# Altium schematic sheet synth.SchDoc
size A; SheetNumber: 1; SheetTotal: 1
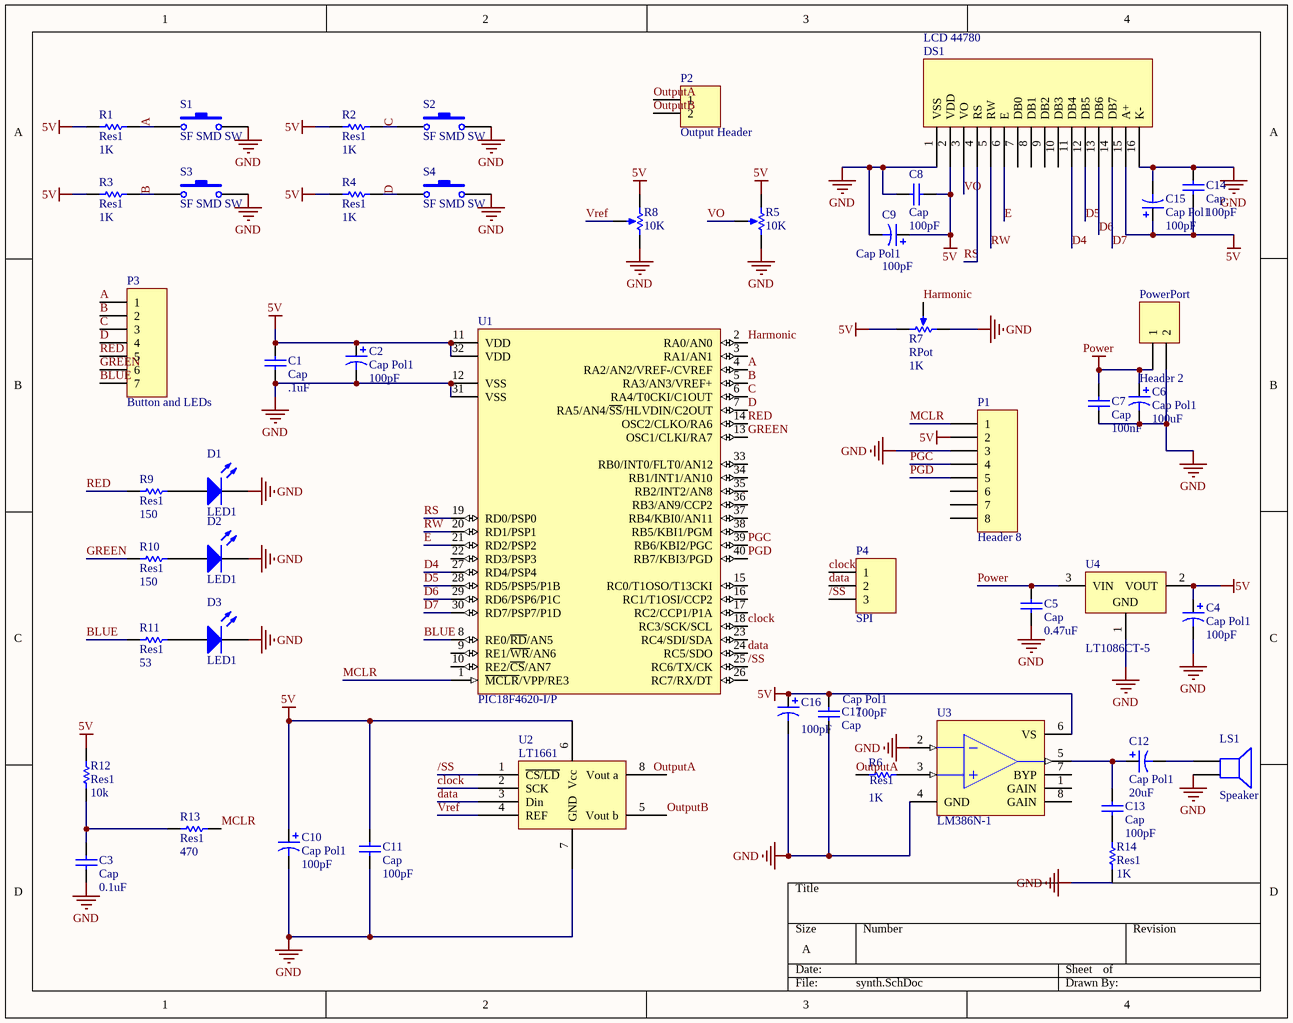
[diagram p0: synth.SchDoc]

## Parts
C1  Cap  value .1uF  [RAD-0.3]
C2  Cap Pol1  value 100pF  [RB7.6-15]
C3  Cap  value 0.1uF  [RAD-0.3]
C4  Cap Pol1  value 100pF  [RB7.6-15]
C5  Cap  value 0.47uF  [RAD-0.3]
C6  Cap Pol1  value 100uF  [RB7.6-15]
C7  Cap  value 100nF  [RAD-0.3]
C8  Cap  value 100pF  [RAD-0.3]
C9  Cap Pol1  value 100pF  [RB7.6-15]
C10  Cap Pol1  value 100pF  [RB7.6-15]
C11  Cap  value 100pF  [RAD-0.3]
C12  Cap Pol1  value 20uF  [RB7.6-15]
C13  Cap  value 100pF  [RAD-0.3]
C14  Cap  value 100pF  [RAD-0.3]
C15  Cap Pol1  value 100pF  [RB7.6-15]
C16  Cap Pol1  value 100pF  [RB7.6-15]
C17  Cap  value 100pF  [RAD-0.3]
D1  LED1  [LED-1]
D2  LED1  [LED-1]
D3  LED1  [LED-1]
DS1  LCD 44780  [OLED 16x2]
LS1  Speaker  [PIN2]
P1  Header 8  [HDR1X8]
P2  Output Header  [HDR1X2]
P3  Button and LEDs  [HDR1X7]
P4  SPI  [HDR1X3]
PowerPort  Header 2  [HDR1X2]
R1  Res1  value 1K  [AXIAL-0.3]
R2  Res1  value 1K  [AXIAL-0.3]
R3  Res1  value 1K  [AXIAL-0.3]
R4  Res1  value 1K  [AXIAL-0.3]
R5  value 10K  [Rpot Square in line]  (hidden comment: RPot_3)
R6  Res1  value 1K  [AXIAL-0.3]
R7  RPot  value 1K  [VR5]
R8  value 10K  [Rpot Square in line]  (hidden comment: RPot_3)
R9  Res1  value 150  [AXIAL-0.3]
R10  Res1  value 150  [AXIAL-0.3]
R11  Res1  value 53  [AXIAL-0.3]
R12  Res1  value 10k  [AXIAL-0.3]
R13  Res1  value 470  [AXIAL-0.3]
R14  Res1  value 1K  [AXIAL-0.3]
S1  SF SMD SW  [SW PB]
S2  SF SMD SW  [SW PB]
S3  SF SMD SW  [SW PB]
S4  SF SMD SW  [SW PB]
U1  PIC18F4620-I/P  [PDIP600-P40]
U2  LT1661  [DIP-8]
U3  LM386N-1  [DIP-8]
U4  LT1086CT-5  [LT-T-3]

## Nets
5V: C1.2 C2.1 C4.1 C8.2 C9.1 C10.1 C11.2 C14.1 C15.1 C16.1 C17.2 DS1.2(VDD) DS1.15(A+) P1.2 R1.1 R2.1 R3.1 R4.1 R5.1(TOP) R7.2(BOT) R8.1(TOP) R12.2 U1.11(VDD) U1.32(VDD) U2.6(Vcc) U3.6(VS) U4.2(VOUT)
GND: C1.1 C2.2 C3.1 C4.2 C5.1 C6.2 C7.1 C8.1 C9.2 C10.2 C11.1 C14.2 C15.2 C16.2 C17.1 D1.2(K) D2.2(K) D3.2(K) DS1.1(VSS) DS1.16(K-) LS1.2 P1.3 PowerPort.2 R5.3(BOT) R7.1(TOP) R8.3(BOT) R14.1 S1.2 S2.2 S3.2 S4.2 U1.12(VSS) U1.31(VSS) U2.7(GND) U3.2(IN-) U3.4(GND) U4.1(GND)
Power: C5.2 C6.1 C7.2 PowerPort.1 U4.3(VIN)
/SS: P4.3 U1.25(RC6/TX/CK) U2.1(~{CS/LD})
A: P3.1 R1.2 S1.1 U1.4(RA2/AN2/VREF-/CVREF)
B: P3.2 R3.2 S3.1 U1.5(RA3/AN3/VREF+)
BLUE: P3.7 R11.1 U1.8(RE0/~{RD}/AN5)
C: P3.3 R2.2 S2.1 U1.6(RA4/T0CKI/C1OUT)
clock: P4.1 U1.18(RC3/SCK/SCL) U2.2(SCK)
D: P3.4 R4.2 S4.1 U1.7(RA5/AN4/~{SS}/HLVDIN/C2OUT)
D4: DS1.11(DB4) U1.27(RD4/PSP4)
D5: DS1.12(DB5) U1.28(RD5/PSP5/P1B)
D6: DS1.13(DB6) U1.29(RD6/PSP6/P1C)
D7: DS1.14(DB7) U1.30(RD7/PSP7/P1D)
data: P4.2 U1.24(RC5/SDO) U2.3(Din)
E: DS1.6(E) U1.21(RD2/PSP2)
GREEN: P3.6 R10.1 U1.13(OSC1/CLKI/RA7)
Harmonic: R7.3(TAP) U1.2(RA0/AN0)
MCLR: P1.1 R13.2 U1.1(~{MCLR}/VPP/RE3)
OutputA: P2.1 R6.1
OutputB: P2.2 U2.5(Vout_b)
PGC: P1.4 U1.39(RB6/KBI2/PGC)
PGD: P1.5 U1.40(RB7/KBI3/PGD)
RED: P3.5 R9.1 U1.14(OSC2/CLKO/RA6)
RS: DS1.4(RS) U1.19(RD0/PSP0)
RW: DS1.5(RW) U1.20(RD1/PSP1)
VO: DS1.3(VO) R5.2(TAP)
Vref: R8.2(TAP) U2.4(REF)
NetC3_2: C3.2 R12.1 R13.1
NetC12_1: C12.1 C13.2 U3.5(OUT)
NetC12_2: C12.2 LS1.1
NetC13_1: C13.1 R14.2
NetD1_1: D1.1(A) R9.2
NetD2_1: D2.1(A) R10.2
NetD3_1: D3.1(A) R11.2
NetR6_2: R6.2 U3.3(IN+)

Not connected (* = marked no-connect by the designer): DS1 7(DB0) 8(DB1) 9(DB2) 10(DB3); P1 6 7 8; U1 3(RA1/AN1) 9(RE1/~{WR}/AN6) 10(RE2/~{CS}/AN7) 15(RC0/T1OSO/T13CKI) 16(RC1/T1OSI/CCP2) 17(RC2/CCP1/P1A) 22(RD3/PSP3) 23(RC4/SDI/SDA) 26(RC7/RX/DT) 33(RB0/INT0/FLT0/AN12) 34(RB1/INT1/AN10) 35(RB2/INT2/AN8) 36(RB3/AN9/CCP2) 37(RB4/KBI0/AN11) 38(RB5/KBI1/PGM); U2 8(Vout_a); U3 1(GAIN) 7(BYP) 8(GAIN)

## Notes on the sheet
- Labels drawn without touching a wire or pin: OutputA

## Library data of the parts
C1 C3 C5 C7 C8 C11 C13 C14 C17 = Cap: Capacitor; Published: 8-Jun-2000; LatestRevisionDate: 17-Jul-2002; LatestRevisionNote: Re-released for DXP Platform.; PackageReference: RAD-0.3; Publisher: Altium Limited; PackageDescription: Radial Cap, Thru-Hole; 2 Leads; 0.3 in Pin Spacing
C2 C4 C6 C9 C10 C12 C15 C16 = Cap Pol1: Polarized Capacitor (Radial); Published: 8-Jun-2000; LatestRevisionDate: 17-Jul-2002; LatestRevisionNote: Re-released for DXP Platform.; PackageReference: RB7.6-15; Publisher: Altium Limited; PackageDescription: Polarized Capacitor (Radial); 2 Leads
D1-D3 = LED1: Typical RED GaAs LED; Published: 8-Jun-2000; LatestRevisionDate: 08-Jul-2005; LatestRevisionNote: Mech Layer 1 removed.; PackageReference: LED-1; Publisher: Altium Limited; PackageDescription: LED; 2 Leads
LS1 = Speaker: Loudspeaker; Published: 24-Mar-1999; LatestRevisionDate: 17-Jul-2002; LatestRevisionNote: Re-released for DXP Platform.; PackageReference: PIN2; Publisher: Altium Limited
P1 = Header 8: Header, 8-Pin; LatestRevisionDate: 17-Jul-2002; LatestRevisionNote: Re-released for DXP Platform.; Publisher: Altium Limited
P2 PowerPort = Header 2: Header, 2-Pin; LatestRevisionDate: 17-Jul-2002; LatestRevisionNote: Re-released for DXP Platform.; Publisher: Altium Limited
P3 = Header 7: Header, 7-Pin; LatestRevisionDate: 17-Jul-2002; LatestRevisionNote: Re-released for DXP Platform.; Publisher: Altium Limited
P4 = Header 3: Header, 3-Pin; LatestRevisionDate: 17-Jul-2002; LatestRevisionNote: Re-released for DXP Platform.; Publisher: Altium Limited
R1-R4 R6 R9-R14 = Res1: Resistor; Published: 8-Jun-2000; LatestRevisionDate: 17-Jul-2002; LatestRevisionNote: Re-released for DXP Platform.; PackageReference: AXIAL-0.3; Publisher: Altium Limited; PackageDescription: Axial Device, Thru-Hole; 2 Leads; 0.3 in Pin Spacing
R5 R8 = RPot_7: Potentiometer; Sim Note: Enter the Resistance value and the set point into parameter fields.; Set Position: 0.5; Published: 8-Jun-2000; LatestRevisionDate: 17-Jul-2002; LatestRevisionNote: Re-released for DXP Platform.; Publisher: Altium Limited
R7 = RPot: Potentiometer; Sim Note: Enter the Resistance value and the set point into parameter fields.; Set Position: 0.5; Published: 8-Jun-2000; LatestRevisionDate: 17-Jul-2002; LatestRevisionNote: Re-released for DXP Platform.; PackageReference: VR5; Publisher: Altium Limited; PackageDescription: Variable Resistor, Thru-Hole; 3 Leads
S1-S4 = SW-PB_1: DIGIKEY SW400-ND; Published: 24-Mar-1999; LatestRevisionDate: 17-Jul-2002; LatestRevisionNote: Re-released for DXP Platform.; Publisher: Altium Limited
U1 = PIC18F4620-I/P: Enhanced Flash Microcontroller with 10-Bit A/D and nanoWatt Technology, 64K Flash, 40-Pin PDIP, Industrial Temperature Range; DatasheetVersion: revE, May-2008; PackageVersion: revBB, Aug-2009; PackageReference: PDIP600-P40; PackageDescription: 40-Lead Plastic Dual In-Line (P) - 600 mil Body [PDIP]; ComponentLink1Description: Manufacturer URL; ComponentLink1URL: http://www.microchip.com/; ComponentLink2Description: Datasheet; ComponentLink2URL: http://ww1.microchip.com/downloads/en/DeviceDoc/39626e.pdf; ComponentLink3Description: Package Specification; ComponentLink3URL: http://www.microchip.com/stellent/groups/techpub_sg/documents/packagingspec/en012702.pdf
U3 = LM386N-1: Low-Voltage Audio Power Amplifier; Published: 15-Apr-2002; DatasheetDocument: Sep-1997; PackageDocument: Sep-1997; PackageReference: N08E; Publisher: Altium Limited
U4 = LT1086CT-5: 1.5 A Low Dropout Positive Regulator, 2.55 to 25 V Vin, 5 V Vout, 3-pin FM (T-3), 0 to 150 degC; Manufacturer: Linear Technology; Discrete Pass Element: no; Dropout Voltage(V): 1.3; Iout(mA): 1500; Isupply(mA): 5; Number of Outputs: 1; Output Voltage: 5 V; PSRR(dB): 68; Vin Max(V): 25; Vin Min(V): 2.55; DatasheetVersion: Rev. F; PackageVersion: Jun-10; PackageReference: T-3; PackageDescription: 3-Pin Plastic TO-220, Body 10.2235 x 4.3815 mm, Pitch 2.54 mm; Supplier 1: Digi-Key; Supplier Part Number 1: LT1086CT-5-ND; Supplier 2: Newark; Supplier Part Number 2: 57M1554; RoHS: FALSE; Mounting Technology: Through Hole; PartNumber: LT1086CT-5; ComponentLink1Description: Manufacturer URL; ComponentLink1URL: http://www.linear.com/; ComponentLink2Description: Datasheet; ComponentLink2URL: http://cds.linear.com/docs/en/datasheet/1086ffs.pdf; ComponentLink3Description: Package Specification; ComponentLink3URL: http://cds.linear.com/docs/en/packaging/TO-220_3_05-08-1420.pdf